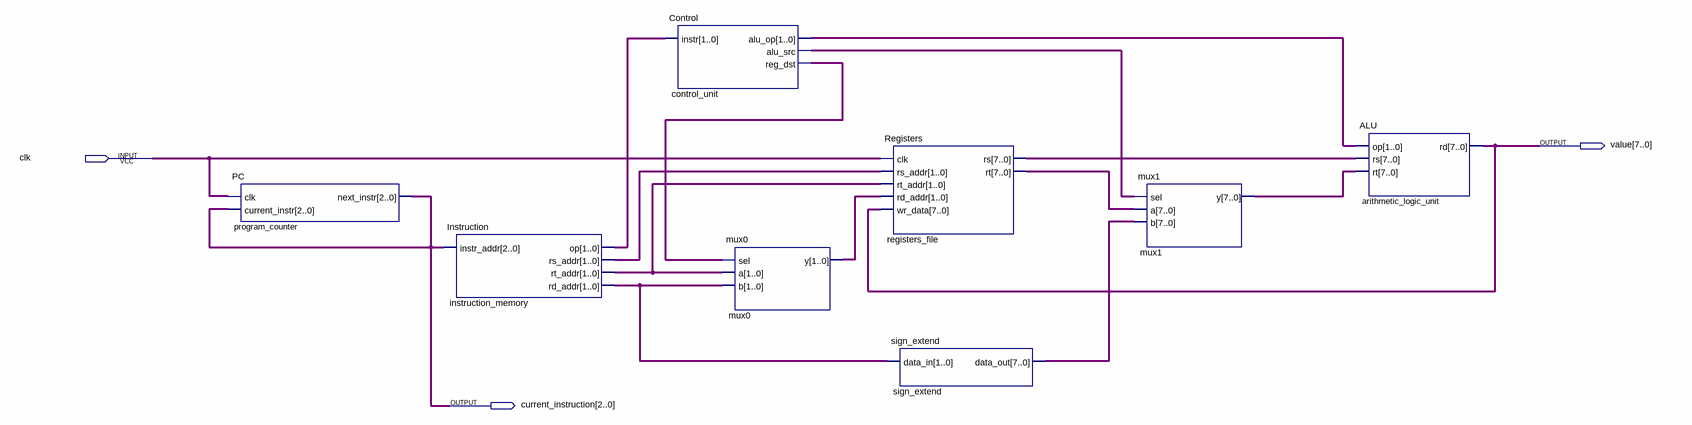
[diagram p0: schematic sheet]
// Quartus schematic Processor.bdf as structural Verilog: 8 symbols, 3 pins
module Processor (
  input  clk,
  output [7:0] value,
  output [2:0] current_instruction
);

  wire control_unit_alu_src, control_unit_reg_dst;
  wire [1:0] control_unit_alu_op, instruction_memory_op, instruction_memory_rd_addr,
       instruction_memory_rs_addr, instruction_memory_rt_addr, mux0_y;
  wire [7:0] mux1_y, registers_file_rs, registers_file_rt, sign_extend_data_out;

  PC program_counter (.clk(clk), .current_instr(current_instruction), .next_instr(current_instruction));
  Instruction instruction_memory (
    .instr_addr(current_instruction), .op(instruction_memory_op), .rs_addr(instruction_memory_rs_addr),
    .rt_addr(instruction_memory_rt_addr), .rd_addr(instruction_memory_rd_addr));
  Control control_unit (
    .instr(instruction_memory_op), .alu_op(control_unit_alu_op), .alu_src(control_unit_alu_src),
    .reg_dst(control_unit_reg_dst));
  mux0 mux0 (.sel(control_unit_reg_dst), .a(instruction_memory_rt_addr), .b(instruction_memory_rd_addr), .y(mux0_y));
  Registers registers_file (
    .clk(clk), .rs_addr(instruction_memory_rs_addr), .rt_addr(instruction_memory_rt_addr), .rd_addr(mux0_y),
    .wr_data(value), .rs(registers_file_rs), .rt(registers_file_rt));
  sign_extend sign_extend (.data_in(instruction_memory_rd_addr), .data_out(sign_extend_data_out));
  mux1 mux1 (.sel(control_unit_alu_src), .a(registers_file_rt), .b(sign_extend_data_out), .y(mux1_y));
  ALU arithmetic_logic_unit (.op(control_unit_alu_op), .rs(registers_file_rs), .rt(mux1_y), .rd(value));
endmodule
